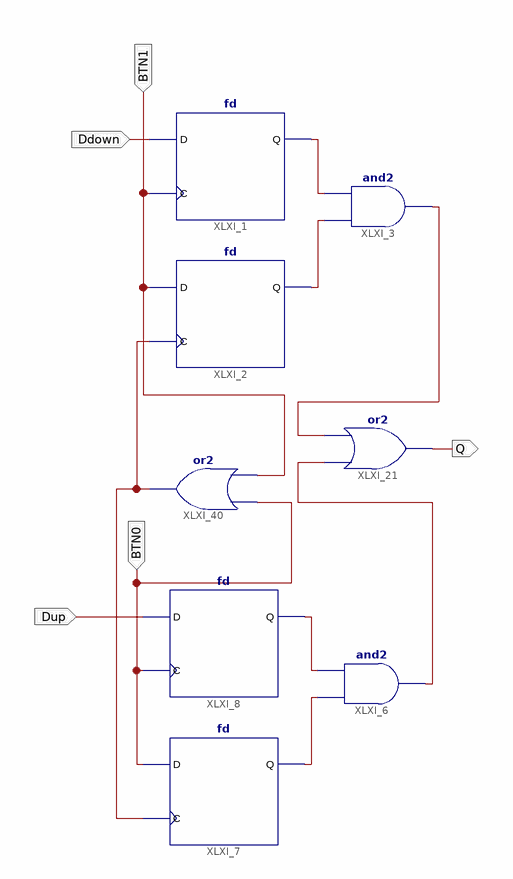
[diagram p0: schematic sheet 1]
// Xilinx ISE schematic bitcollecter.sch (spartan3) as structural Verilog: 8 symbols, 5 ports
module bitcollecter (
  input  BTN1,
  input  Ddown,
  input  Dup,
  input  BTN0,
  output Q
);

  wire XLXN_3, XLXN_5, XLXN_10, XLXN_11, XLXN_45, XLXN_46, XLXN_142;

  fd XLXI_1 (.C(BTN1), .D(Ddown), .Q(XLXN_3));
  fd XLXI_2 (.C(XLXN_142), .D(BTN1), .Q(XLXN_5));
  and XLXI_3 (XLXN_45, XLXN_5, XLXN_3);
  or XLXI_21 (Q, XLXN_46, XLXN_45);
  or XLXI_40 (XLXN_142, BTN1, BTN0);
  and XLXI_6 (XLXN_46, XLXN_10, XLXN_11);
  fd XLXI_7 (.C(XLXN_142), .D(BTN0), .Q(XLXN_10));
  fd XLXI_8 (.C(BTN0), .D(Dup), .Q(XLXN_11));
endmodule
